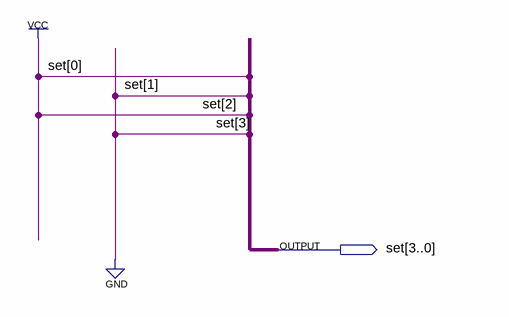
[diagram p0: schematic sheet]
// Quartus schematic num_4b_5d.bdf as structural Verilog: 0 symbols, 1 pins
module num_4b_5d (
  output [3:0] set
);


  assign set = 4'b0101;
endmodule
